# Altium schematic sheet DemoCatV3.SchDoc
size A3
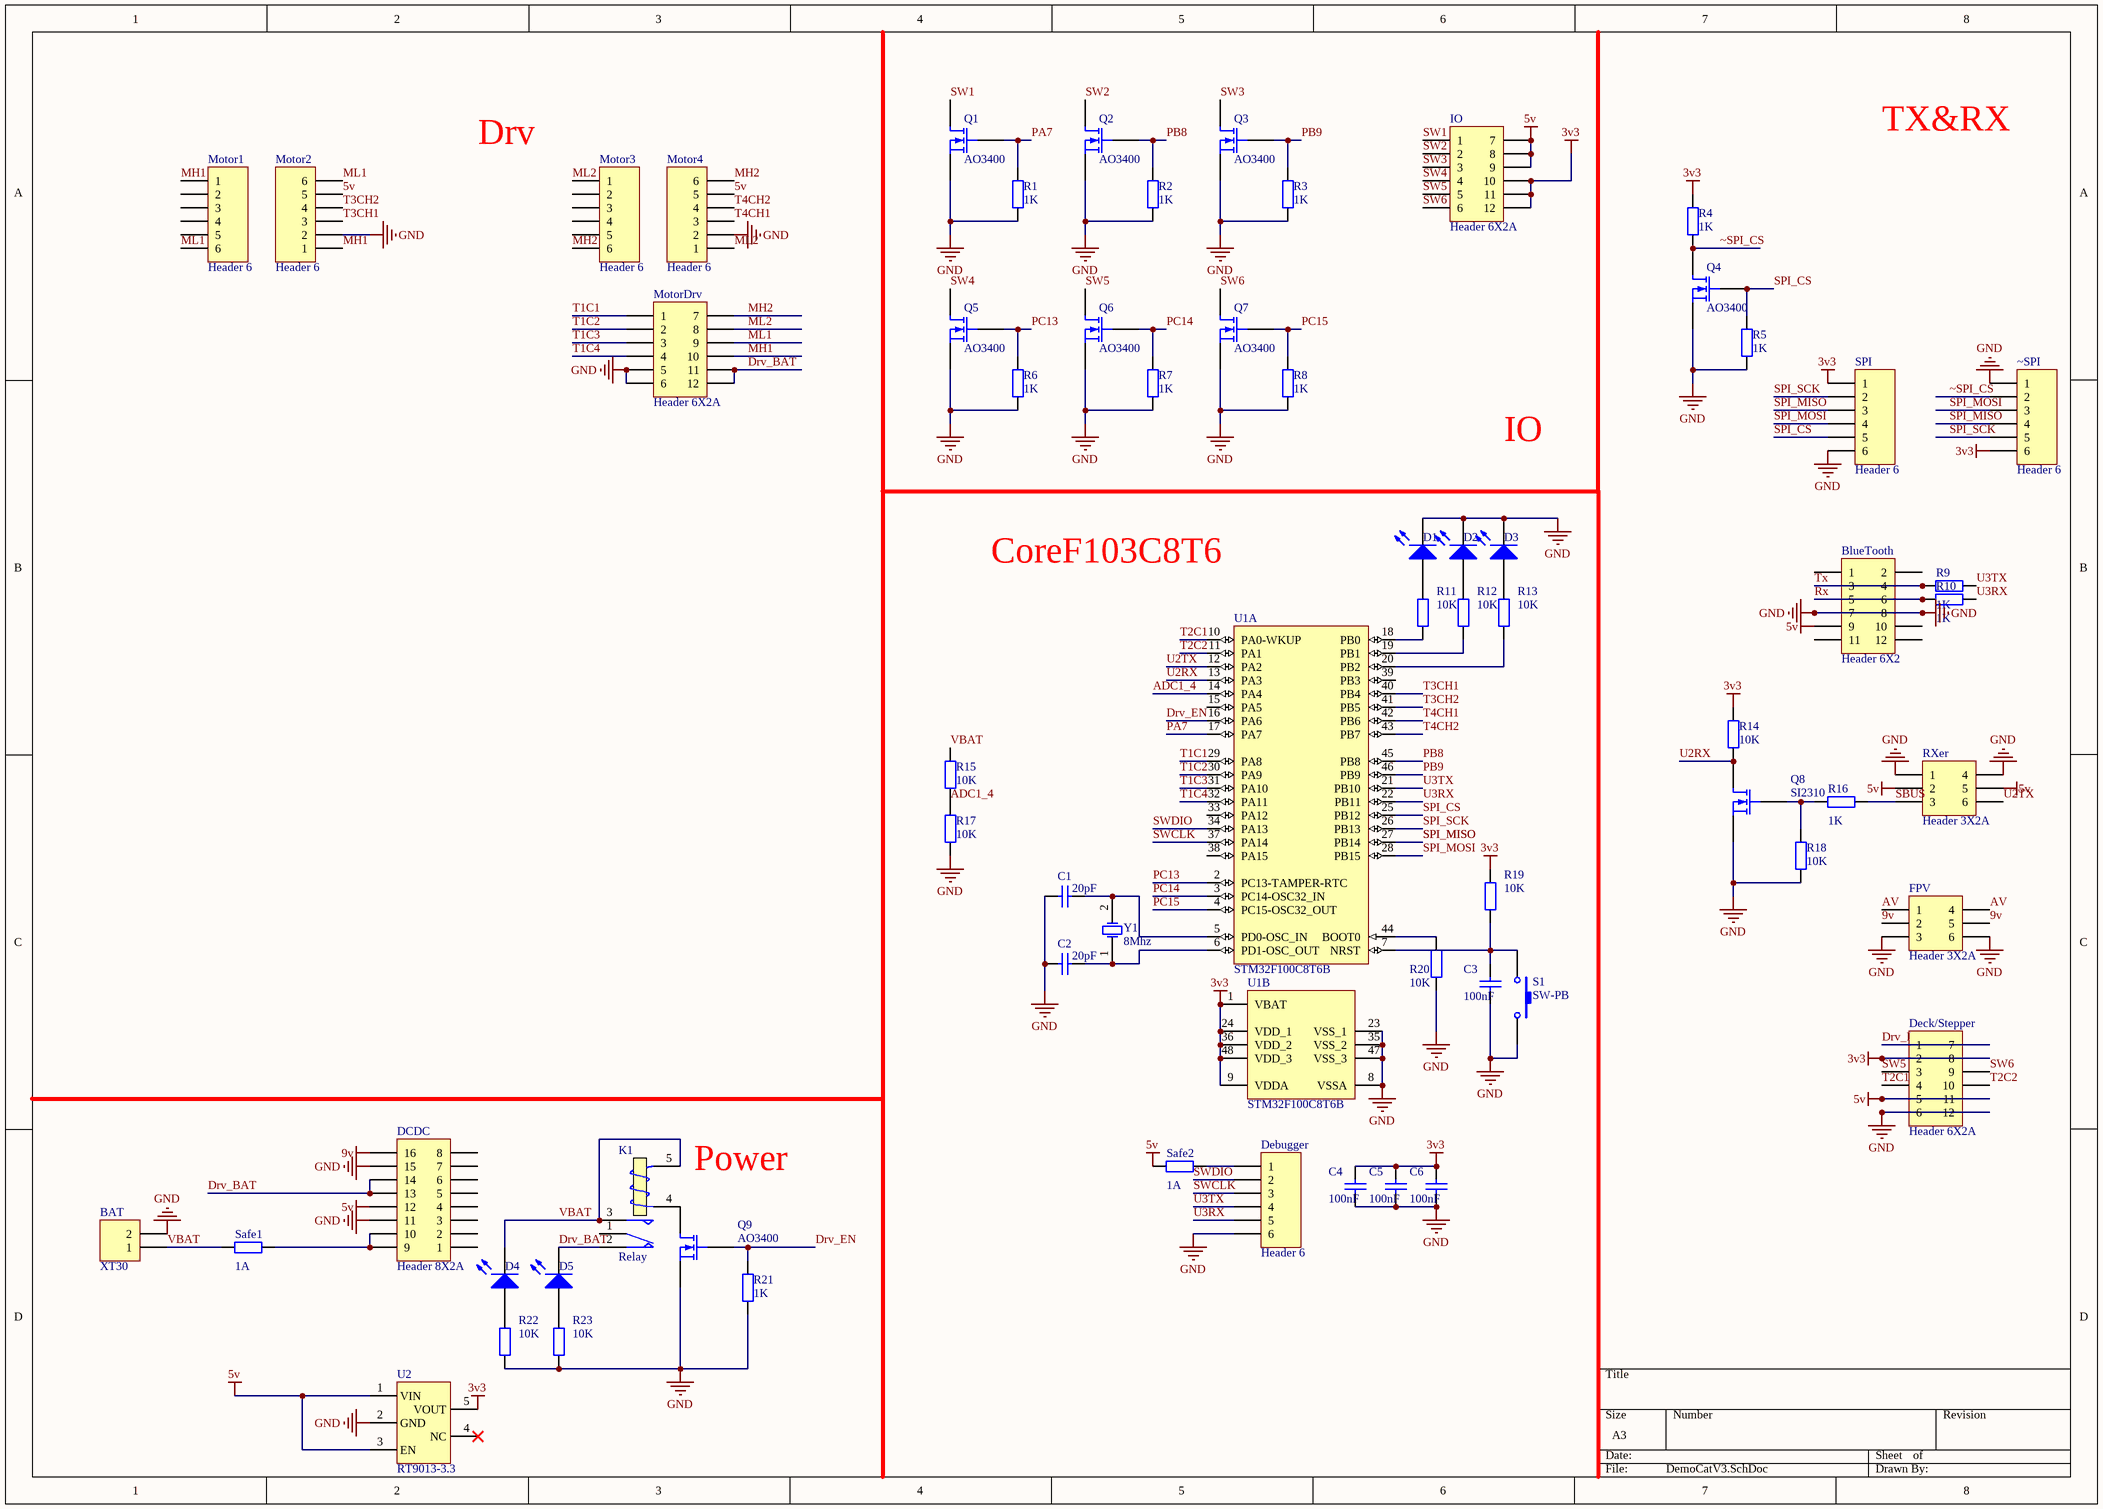
[diagram p0: DemoCatV3.SchDoc]

## Parts
BAT  XT30  [XT30-IN-W]
BlueTooth  Header 6X2  [HDR2X6]
C1  value 20pF  [0603C]  (hidden comment: Cap)
C2  value 20pF  [0603C]  (hidden comment: Cap)
C3  value 100nF  [0603C]  (hidden comment: Cap)
C4  value 100nF  [0603C]  (hidden comment: Cap)
C5  value 100nF  [0603C]  (hidden comment: Cap)
C6  value 100nF  [0603C]  (hidden comment: Cap)
D1  LED0  [0603LED - Red]  (value not drawn)
D2  LED0  [0603LED - Green]  (value not drawn)
D3  LED0  [0603LED - Blue]  (value not drawn)
D4  LED0  [0603LED - Red]  (value not drawn)
D5  LED0  [0603LED - Red]  (value not drawn)
DCDC  Header 8X2A  [HDR_EDGE_2x8]
Debugger  Header 6  [GX1.25_T_6P]
Deck/Stepper  Header 6X2A  [HDR_EDGE_2x6]
FPV  Header 3X2A  [HDR_EDGE_2x3]
IO  Header 6X2A  [HDR_EDGE_2x6]
K1  Relay  [RY-HF46-HS1]
Motor1  Header 6  [PH-PS-2.0-6]
Motor2  Header 6  [PH-PS-2.0-6]
Motor3  Header 6  [PH-PS-2.0-6]
Motor4  Header 6  [PH-PS-2.0-6]
MotorDrv  Header 6X2A  [HDR_EDGE_2x6]
Q1  AO3400  [SOT-23-MOS]
Q2  AO3400  [SOT-23-MOS]
Q3  AO3400  [SOT-23-MOS]
Q4  AO3400  [SOT-23-MOS]
Q5  AO3400  [SOT-23-MOS]
Q6  AO3400  [SOT-23-MOS]
Q7  AO3400  [SOT-23-MOS]
Q8  SI2310  [SOT-23-MOS]
Q9  AO3400  [SOT-23-MOS]
R1  value 1K  [0603R]  (hidden comment: Res2)
R2  value 1K  [0603R]  (hidden comment: Res2)
R3  value 1K  [0603R]  (hidden comment: Res2)
R4  value 1K  [0603R]  (hidden comment: Res2)
R5  value 1K  [0603R]  (hidden comment: Res2)
R6  value 1K  [0603R]  (hidden comment: Res2)
R7  value 1K  [0603R]  (hidden comment: Res2)
R8  value 1K  [0603R]  (hidden comment: Res2)
R9  value 1K  [0603R]  (hidden comment: Res2)
R10  value 1K  [0603R]  (hidden comment: Res2)
R11  10K  [0603R]
R12  10K  [0603R]
R13  10K  [0603R]
R14  value 10K  [0603R]  (hidden comment: Res2)
R15  value 10K  [0603R]  (hidden comment: Res2)
R16  value 1K  [0603R]  (hidden comment: Res2)
R17  value 10K  [0603R]  (hidden comment: Res2)
R18  value 10K  [0603R]  (hidden comment: Res2)
R19  10K  [0603R]
R20  value 10K  [0603R]  (hidden comment: Res2)
R21  value 1K  [0603R]  (hidden comment: Res2)
R22  10K  [0603R]
R23  10K  [0603R]
RXer  Header 3X2A  [HDR_EDGE_2x3]
S1  SW-PB  [KeySwitch-3X3]
Safe1  value 1A  [0805R]  (hidden comment: Res2)
Safe2  value 1A  [0805R]  (hidden comment: Res2)
SPI  Header 6  [GX1.25_T_6P]
U1  STM32F100C8T6B  [LQFN-48]  (parts A,B of 2)
U2  RT9013-3.3  [SOT-23-5]
Y1  8Mhz  [OSC 3215-2P]
~SPI  Header 6  [GX1.25_T_6P]

## Nets
3v3: C4.2 C5.2 C6.2 Deck/Stepper.2 Deck/Stepper.8 IO.10 IO.11 IO.12 R4.2 R14.2 R19.2 SPI.1 U1.1(VBAT) U1.9(VDDA) U1.24(VDD_1) U1.36(VDD_2) U1.48(VDD_3) U2.5(VOUT) ~SPI.6
5v: BlueTooth.9 DCDC.12 Deck/Stepper.5 Deck/Stepper.11 IO.7 IO.8 IO.9 Motor2.5 Motor4.5 RXer.2 RXer.5 Safe2.1 U2.1(VIN) U2.3(EN)
9v: DCDC.16 FPV.2 FPV.5
GND: BAT.2 BlueTooth.7 BlueTooth.8 C1.1 C2.1 C3.1 C4.1 C5.1 C6.1 D1.2(K) D2.2(K) D3.2(K) DCDC.11 DCDC.15 Debugger.6 Deck/Stepper.6 Deck/Stepper.12 FPV.3 FPV.6 Motor2.2 Motor4.2 MotorDrv.5 MotorDrv.6 Q1.3(S) Q2.3(S) Q3.3(S) Q4.3(S) Q5.3(S) Q6.3(S) Q7.3(S) Q8.3(S) Q9.3(S) R1.1 R2.1 R3.1 R5.1 R6.1 R7.1 R8.1 R17.1 R18.1 R20.1 R21.1 R22.1 R23.1 RXer.1 RXer.4 S1.2 SPI.6 U1.8(VSSA) U1.23(VSS_1) U1.35(VSS_2) U1.47(VSS_3) U2.2(GND) ~SPI.1
ADC1_4: R15.1 R17.2 U1.14(PA4)
AV: FPV.1 FPV.4
Drv_BAT: D5.2(K) DCDC.13 DCDC.14 Deck/Stepper.1 Deck/Stepper.7 K1.2(NC) MotorDrv.11 MotorDrv.12
Drv_EN: Q9.2(G) R21.2 U1.16(PA6)
MH1: Motor1.1 Motor2.1 MotorDrv.10
MH2: Motor3.6 Motor4.6 MotorDrv.7
ML1: Motor1.6 Motor2.6 MotorDrv.9
ML2: Motor3.1 Motor4.1 MotorDrv.8
PA7: Q1.2(G) R1.2 U1.17(PA7)
PB8: Q2.2(G) R2.2 U1.45(PB8)
PB9: Q3.2(G) R3.2 U1.46(PB9)
PC13: Q5.2(G) R6.2 U1.2(PC13-TAMPER-RTC)
PC14: Q6.2(G) R7.2 U1.3(PC14-OSC32_IN)
PC15: Q7.2(G) R8.2 U1.4(PC15-OSC32_OUT)
Rx: BlueTooth.5 BlueTooth.6 R10.1
SBUS: R16.2 RXer.3
SPI_CS: Q4.2(G) R5.2 SPI.5 U1.25(PB12)
SPI_MISO: SPI.3 U1.27(PB14) ~SPI.4
SPI_MOSI: SPI.4 U1.28(PB15) ~SPI.3
SPI_SCK: SPI.2 U1.26(PB13) ~SPI.5
SW1: IO.1 Q1.1(D)
SW2: IO.2 Q2.1(D)
SW3: IO.3 Q3.1(D)
SW4: IO.4 Q5.1(D)
SW5: Deck/Stepper.3 IO.5 Q6.1(D)
SW6: Deck/Stepper.9 IO.6 Q7.1(D)
SWCLK: Debugger.3 U1.37(PA14)
SWDIO: Debugger.2 U1.34(PA13)
T1C1: MotorDrv.1 U1.29(PA8)
T1C2: MotorDrv.2 U1.30(PA9)
T1C3: MotorDrv.3 U1.31(PA10)
T1C4: MotorDrv.4 U1.32(PA11)
T2C1: Deck/Stepper.4 U1.10(PA0-WKUP)
T2C2: Deck/Stepper.10 U1.11(PA1)
T3CH1: Motor2.3 U1.40(PB4)
T3CH2: Motor2.4 U1.41(PB5)
T4CH1: Motor4.3 U1.42(PB6)
T4CH2: Motor4.4 U1.43(PB7)
Tx: BlueTooth.3 BlueTooth.4 R9.1
U2RX: Q8.1(D) R14.1 U1.13(PA3)
U2TX: RXer.6 U1.12(PA2)
U3RX: Debugger.5 R10.2 U1.22(PB11)
U3TX: Debugger.4 R9.2 U1.21(PB10)
VBAT: BAT.1 D4.2(K) K1.3(NO) K1.5(T2) R15.2 Safe1.1
~SPI_CS: Q4.1(D) R4.1 ~SPI.2
NetC1_2: C1.2 U1.5(PD0-OSC_IN) Y1.2(OSC2)
NetC2_2: C2.2 U1.6(PD1-OSC_OUT) Y1.1(OSC1)
NetC3_2: C3.2 R19.1 S1.1 U1.7(NRST)
NetD1_1: D1.1(A) R11.2
NetD2_1: D2.1(A) R12.2
NetD3_1: D3.1(A) R13.2
NetD4_1: D4.1(A) R22.2
NetD5_1: D5.1(A) R23.2
NetDCDC_9: DCDC.9 DCDC.10 Safe1.2
NetDebugger_1: Debugger.1 Safe2.2
NetK1_4: K1.4(T1) Q9.1(D)
NetQ8_2: Q8.2(G) R16.1 R18.2
NetR11_1: R11.1 U1.18(PB0)
NetR12_1: R12.1 U1.19(PB1)
NetR13_1: R13.1 U1.20(PB2)
NetR20_2: R20.2 U1.44(BOOT0)

Not connected (* = marked no-connect by the designer): BlueTooth 1 2 10 11 12; DCDC 1 2 3 4 5 6 7 8; K1 1(COM); Motor1 2 3 4 5; Motor3 2 3 4 5; U1 15(PA5) 33(PA12) 38(PA15) 39(PB3); U2 4(NC)*

## Notes on the sheet
- Drv
- TX&RX
- IO
- CoreF103C8T6
- Power

## Library data of the parts
BAT = Header 2: Header, 2-Pin; LatestRevisionDate: 17-Jul-2002; LatestRevisionNote: Re-released for DXP Platform.; Publisher: Altium Limited
BlueTooth = Header 6X2: Header, 6-Pin, Dual row; LatestRevisionDate: 17-Jul-2002; LatestRevisionNote: Re-released for DXP Platform.; Publisher: Altium Limited
C1-C6 = Cap: Capacitor; Published: 8-Jun-2000; LatestRevisionDate: 17-Jul-2002; LatestRevisionNote: Re-released for DXP Platform.; PackageReference: RAD-0.3; Publisher: Altium Limited; PackageDescription: Radial Cap, Thru-Hole; 2 Leads; 0.3 in Pin Spacing
D1-D5 = LED0: Typical INFRARED GaAs LED; Published: 8-Jun-2000; LatestRevisionDate: 08-Jul-2005; LatestRevisionNote: Mech Layer 1 removed.; PackageReference: LED-0; Publisher: Altium Limited; PackageDescription: LED; 2 Leads
DCDC = Header 8X2A: Header, 8-Pin, Dual row; LatestRevisionDate: 17-Jul-2002; LatestRevisionNote: Re-released for DXP Platform.; Publisher: Altium Limited
Debugger Motor1-Motor4 SPI ~SPI = Header 6: Header, 6-Pin; LatestRevisionDate: 17-Jul-2002; LatestRevisionNote: Re-released for DXP Platform.; Publisher: Altium Limited
Deck/Stepper IO MotorDrv = Header 6X2A: Header, 6-Pin, Dual row; LatestRevisionDate: 17-Jul-2002; LatestRevisionNote: Re-released for DXP Platform.; Publisher: Altium Limited
FPV RXer = Header 3X2A: Header, 3-Pin, Dual row; LatestRevisionDate: 17-Jul-2002; LatestRevisionNote: Re-released for DXP Platform.; Publisher: Altium Limited
K1 = Relay: SPDT Relay; Published: 8-Jun-2000; LatestRevisionDate: 17-Jul-2002; LatestRevisionNote: Re-released for DXP Platform.; PackageReference: MODULE5B; Publisher: Altium Limited
Q1-Q9 = MOSFET-N: N-Channel MOSFET; Published: 8-Jun-2000; LatestRevisionDate: 17-Jul-2002; LatestRevisionNote: Re-released for DXP Platform.; PackageVersion: 1995/1996; PackageReference: E3; Publisher: Altium Limited; PackageDescription: TO, Flat Index; 3 In-Line, Axial Leads; Body Dia. 4.6mm; Lead Dia. 0.5 mm (max)
R1-R23 Safe1 Safe2 = Res2: Resistor; Published: 8-Jun-2000; LatestRevisionDate: 17-Jul-2002; LatestRevisionNote: Re-released for DXP Platform.; PackageReference: AXIAL-0.4; Publisher: Altium Limited; PackageDescription: Axial Device, Thru-Hole; 2 Leads; 0.4 in Pin Spacing
  R11-R13 R19 R22 R23: Value: 10K
S1 = SW-PB: Switch; Published: 24-Mar-1999; LatestRevisionDate: 17-Jul-2002; LatestRevisionNote: Re-released for DXP Platform.; PackageReference: SPST-2; Publisher: Altium Limited; PackageDescription: Switch; 2 Leads
U1 = STM32F100C8T6B: ARM Cortex-M3 32-bit MCU, 64 KB Flash, 8 KB Internal RAM, 37 I/Os, 48-pin LQFP, -40 to 85 degC, Tray; A/D Converter: 1x12-bit (10 Channel); D/A Converter: 2x12-bit (2 Channel); FLASH Size (Prog) (kB): 64; I/Os (High Current): 37; Internal RAM Size (kB): 8; Operating Frequency(F) (Processor speed) (MHz): 24; Supply Voltage(Vcc) min (V): 2; DatasheetVersion: Rev. 7; PackageVersion: Rev. 6, 06/2013; PackageReference: LQFP48; PackageDescription: 48-Pin Low Profile Quad Flat Package, 7 x 7 mm Body, 0.5 mm Pitch; Supplier 1: Digi-Key; Supplier Part Number 1: 497-10499-ND; Supplier 2: Farnell; Supplier Part Number 2: 1838511; Supplier 3: Newark; Supplier Part Number 3: 76R0988; Supplier 4: Mouser; Supplier Part Number 4: 511-STM32F100C8T6B; Core: ARM Cortex-M3; Packing: Tray; Mounting Technology: Surface Mount; PartNumber: STM32F100C8T6B; ComponentLink1Description: Manufacturer URL; ComponentLink1URL: http://www.st.com/web/en/home.html; ComponentLink2Description: Datasheet; ComponentLink2URL: http://www.st.com/st-web-ui/static/active/en/resource/technical/document/datasheet/CD00251732.pdf; ComponentLink3Description: Package Specification; ComponentLink3URL: http://www.st.com/st-web-ui/static/active/en/resource/technical/document/datasheet/DM00058181.pdf
U2 = RT9013: 3.3V 500mA
Y1 = XTAL: Published: 8-Jun-2000; LatestRevisionDate: 17-Jul-2002; LatestRevisionNote: Re-released for DXP Platform.; PackageReference: R38; Publisher: Altium Limited; PackageDescription: Crystal, Thru-Hole; 2 Leads; Body 3.1 x 8.2 mm (Dia.xH)